# Altium schematic sheet J4.schdoc: TEBF0808 - B2B-connector J3
size A4; DocumentNumber: TEBF0808; Revision: 04; SheetNumber: 6; SheetTotal: 36; Date: 2016-09-29; CompanyName: Trenz Electronic GmbH; Organization: Trenz Electronic GmbH
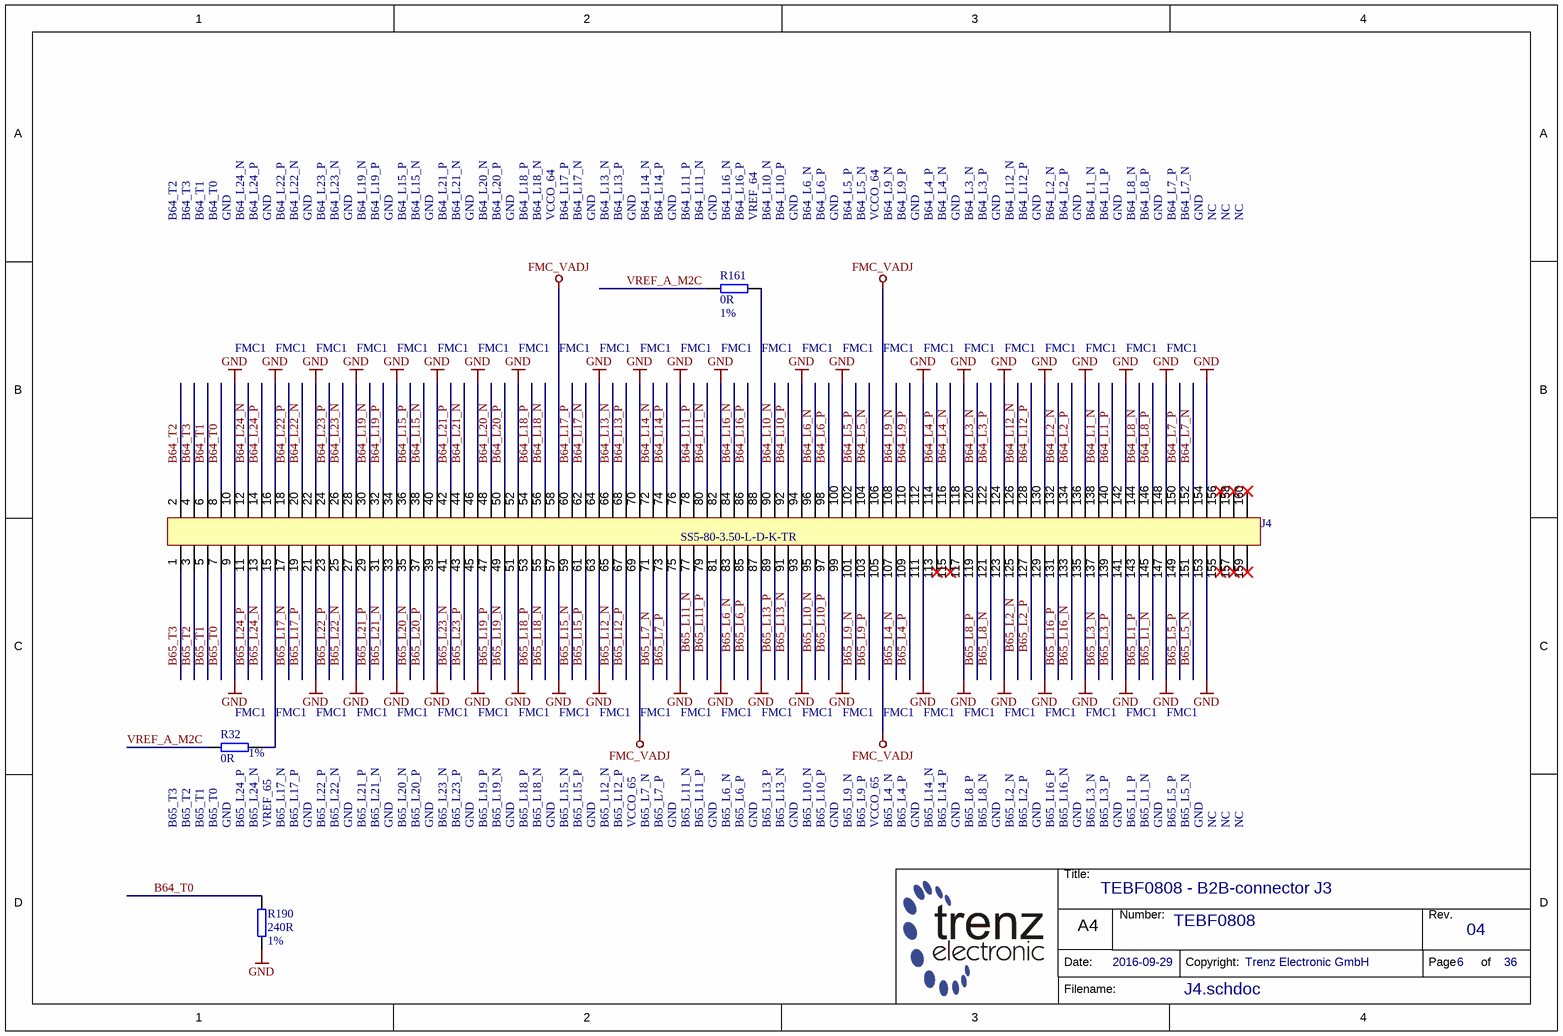
[diagram p0: J4.schdoc]

## Parts
J4  SS5-80-3.50-L-D-K-TR  [SS5-80-3.50-L-D-K-TR]
R32  0R  Tolerance: 1%  [RESC1005X40N]
R161  0R  Tolerance: 1%  [RESC1005X40N]
R190  240R  Tolerance: 1%  [RESC1005X40N]

## Nets
FMC_VADJ: J4.58 J4.69 J4.105 J4.106
GND: J4.9 J4.10 J4.16 J4.21 J4.22 J4.27 J4.28 J4.33 J4.34 J4.39 J4.40 J4.45 J4.46 J4.51 J4.52 J4.57 J4.63 J4.64 J4.70 J4.75 J4.76 J4.81 J4.82 J4.87 J4.93 J4.94 J4.99 J4.100 J4.111 J4.112 J4.117 J4.118 J4.123 J4.124 J4.129 J4.130 J4.135 J4.136 J4.141 J4.142 J4.147 J4.148 J4.153 J4.154 R190.2
B64_L1_N: J4.138
B64_L1_P: J4.140
B64_L2_N: J4.132
B64_L2_P: J4.134
B64_L3_N: J4.120
B64_L3_P: J4.122
B64_L4_N: J4.116
B64_L4_P: J4.114
B64_L5_N: J4.104
B64_L5_P: J4.102
B64_L6_N: J4.96
B64_L6_P: J4.98
B64_L7_N: J4.152
B64_L7_P: J4.150
B64_L8_N: J4.144
B64_L8_P: J4.146
B64_L9_N: J4.108
B64_L9_P: J4.110
B64_L10_N: J4.90
B64_L10_P: J4.92
B64_L11_N: J4.80
B64_L11_P: J4.78
B64_L12_N: J4.126
B64_L12_P: J4.128
B64_L13_N: J4.66
B64_L13_P: J4.68
B64_L14_N: J4.72
B64_L14_P: J4.74
B64_L15_N: J4.38
B64_L15_P: J4.36
B64_L16_N: J4.84
B64_L16_P: J4.86
B64_L17_N: J4.62
B64_L17_P: J4.60
B64_L18_N: J4.56
B64_L18_P: J4.54
B64_L19_N: J4.30
B64_L19_P: J4.32
B64_L20_N: J4.48
B64_L20_P: J4.50
B64_L21_N: J4.44
B64_L21_P: J4.42
B64_L22_N: J4.20
B64_L22_P: J4.18
B64_L23_N: J4.26
B64_L23_P: J4.24
B64_L24_N: J4.12
B64_L24_P: J4.14
B64_T0: J4.8 R190.1
B64_T1: J4.6
B64_T2: J4.2
B64_T3: J4.4
B65_L1_N: J4.145
B65_L1_P: J4.143
B65_L2_N: J4.125
B65_L2_P: J4.127
B65_L3_N: J4.137
B65_L3_P: J4.139
B65_L4_N: J4.107
B65_L4_P: J4.109
B65_L5_N: J4.151
B65_L5_P: J4.149
B65_L6_N: J4.83
B65_L6_P: J4.85
B65_L7_N: J4.71
B65_L7_P: J4.73
B65_L8_N: J4.121
B65_L8_P: J4.119
B65_L9_N: J4.101
B65_L9_P: J4.103
B65_L10_N: J4.95
B65_L10_P: J4.97
B65_L11_N: J4.77
B65_L11_P: J4.79
B65_L12_N: J4.65
B65_L12_P: J4.67
B65_L13_N: J4.91
B65_L13_P: J4.89
B65_L15_N: J4.59
B65_L15_P: J4.61
B65_L16_N: J4.133
B65_L16_P: J4.131
B65_L17_N: J4.17
B65_L17_P: J4.19
B65_L18_N: J4.55
B65_L18_P: J4.53
B65_L19_N: J4.49
B65_L19_P: J4.47
B65_L20_N: J4.35
B65_L20_P: J4.37
B65_L21_N: J4.31
B65_L21_P: J4.29
B65_L22_N: J4.25
B65_L22_P: J4.23
B65_L23_N: J4.41
B65_L23_P: J4.43
B65_L24_N: J4.13
B65_L24_P: J4.11
B65_T0: J4.7
B65_T1: J4.5
B65_T2: J4.3
B65_T3: J4.1
VREF_A_M2C: R32.2 R161.1
NetJ4_15: J4.15 R32.1
NetJ4_88: J4.88 R161.2

Not connected (* = marked no-connect by the designer): J4 113* 115* 155* 156* 157* 158* 159* 160*

## Notes on the sheet
- B64_T2
- B64_T3
- B64_T1
- B64_T0
- GND
- B64_L24_N
- B64_L24_P
- B64_L22_P
- B64_L22_N
- B64_L23_P
- B64_L23_N
- B64_L19_N
- B64_L19_P
- B64_L15_P
- B64_L15_N
- B64_L21_P
- B64_L21_N
- B64_L20_N
- B64_L20_P
- B64_L18_P
- B64_L18_N
- VCCO_64
- B64_L17_P
- B64_L17_N
- B64_L13_N
- B64_L13_P
- B64_L14_N
- B64_L14_P
- B64_L11_P
- B64_L11_N
- B64_L16_N
- B64_L16_P
- VREF_64
- B64_L10_N
- B64_L10_P
- B64_L6_N
- B64_L6_P
- B64_L5_P
- B64_L5_N
- B64_L9_N
- B64_L9_P
- B64_L4_P
- B64_L4_N
- B64_L3_N
- B64_L3_P
- B64_L12_N
- B64_L12_P
- B64_L2_N
- B64_L2_P
- B64_L1_N
- B64_L1_P
- B64_L8_N
- B64_L8_P
- B64_L7_P
- B64_L7_N
- NC
- FMC1
- (near R32) FMC1
- B65_T3
- (near R32) B65_T2
- (near R32) B65_T1
- (near R32) B65_T0
- (near R32) B65_L24_P
- (near R32) B65_L24_N
- (near R32) VREF_65
- (near R32) B65_L17_N
- (near R32) B65_L17_P
- B65_L22_P
- B65_L22_N
- B65_L21_P
- B65_L21_N
- B65_L20_N
- B65_L20_P
- B65_L23_N
- B65_L23_P
- B65_L19_P
- B65_L19_N
- B65_L18_P
- B65_L18_N
- B65_L15_N
- B65_L15_P
- B65_L12_N
- B65_L12_P
- VCCO_65
- B65_L7_N
- B65_L7_P
- B65_L11_N
- B65_L11_P
- B65_L6_N
- B65_L6_P
- B65_L13_P
- B65_L13_N
- B65_L10_N
- B65_L10_P
- B65_L9_N
- B65_L9_P
- B65_L4_N
- B65_L4_P
- B65_L14_N
- B65_L14_P
- B65_L8_P
- B65_L8_N
- B65_L2_N
- B65_L2_P
- B65_L16_P
- B65_L16_N
- B65_L3_N
- B65_L3_P
- B65_L1_P
- B65_L1_N
- B65_L5_P
- B65_L5_N
- Title:
- Number:
- Rev.
- Date:
- A4
- Copyright:
- Page
- of
- Filename:

## Library data of the parts
J4 = 27219: Samtec Ultra Fine Pitch Socket REF192552-01, 160 Pins; AN: 27219; Mixed: SMT; Preferred: Yes; HelpURL: B:\ad\adlib\datasheet\SS5-XX-X.XX-X-D-K-TR; H-ART: REF 192552-01
R32 R161 = 22738: WID SMD 0R; AN: 22738; Mixed: SMT; Value: 0; Preferred: Yes; Case: 1005 (0402); Technology: TK100
R190 = 23661: WID SMD 240R 1% 0,063W; AN: 23661; Mixed: SMT; Value: 240; Preferred: Yes; Case: 1005 (0402); Technology: TK100